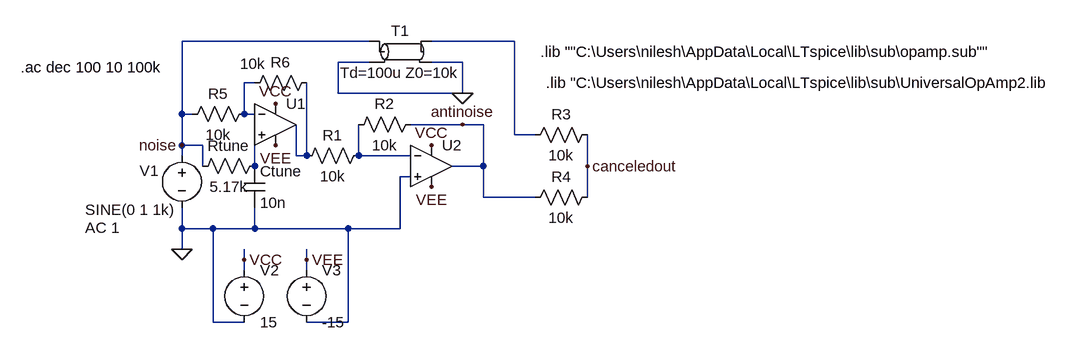
[diagram p0: schematic NC_schematic_real_world_model.asc]
NC_schematic_real_world_model.asc, the LTspice schematic file:
Version 4.1
SHEET 1 1500 680
WIRE 336 -48 48 -48
WIRE 560 -48 432 -48
WIRE 336 -16 288 -16
WIRE 480 -16 432 -16
WIRE 160 16 144 16
WIRE 288 32 288 -16
WIRE 480 32 480 -16
WIRE 480 32 288 32
WIRE 48 64 48 -48
WIRE 64 64 48 64
WIRE 144 64 144 16
WIRE 160 64 144 64
WIRE 480 80 400 80
WIRE 512 80 480 80
WIRE 560 96 560 -48
WIRE 592 96 560 96
WIRE 48 112 48 64
WIRE 80 112 48 112
WIRE 48 128 48 112
WIRE 224 128 224 80
WIRE 240 128 240 16
WIRE 240 128 224 128
WIRE 320 128 320 80
WIRE 400 128 320 128
WIRE 80 144 80 112
WIRE 160 144 160 96
WIRE 512 144 512 80
WIRE 512 144 464 144
WIRE 672 144 672 96
WIRE 400 160 384 160
WIRE 512 192 512 144
WIRE 592 192 512 192
WIRE 672 192 672 144
WIRE 48 240 48 208
WIRE 96 240 48 240
WIRE 160 240 160 208
WIRE 160 240 96 240
WIRE 304 240 160 240
WIRE 384 240 384 160
WIRE 384 240 304 240
WIRE 48 272 48 240
WIRE 144 288 144 272
WIRE 240 288 240 272
WIRE 144 304 144 288
WIRE 240 304 240 288
WIRE 96 384 96 240
WIRE 144 384 96 384
WIRE 304 384 304 240
WIRE 304 384 240 384
FLAG 48 272 0
FLAG 480 80 antinoise
FLAG 672 144 canceledout
FLAG 480 32 0
FLAG 48 112 noise
FLAG 144 288 VCC
FLAG 240 288 VEE
FLAG 192 48 VCC
FLAG 432 112 VCC
FLAG 432 176 VEE
FLAG 192 112 VEE
SYMBOL voltage 48 112 R0
WINDOW 123 -149 127 Left 2
WINDOW 39 0 0 Left 0
WINDOW 0 -65 39 Left 2
WINDOW 3 -149 99 Left 2
SYMATTR Value2 AC 1
SYMATTR InstName V1
SYMATTR Value SINE(0 1 1k)
SYMBOL res 336 112 R90
WINDOW 0 0 56 VBottom 2
WINDOW 3 32 56 VTop 2
SYMATTR InstName R1
SYMATTR Value 10k
SYMBOL res 416 64 R90
WINDOW 0 0 56 VBottom 2
WINDOW 3 32 56 VTop 2
SYMATTR InstName R2
SYMATTR Value 10k
SYMBOL res 688 80 R90
WINDOW 0 0 56 VBottom 2
WINDOW 3 32 56 VTop 2
SYMATTR InstName R3
SYMATTR Value 10k
SYMBOL res 688 176 R90
WINDOW 0 0 56 VBottom 2
WINDOW 3 32 56 VTop 2
SYMATTR InstName R4
SYMATTR Value 10k
SYMBOL tline 384 -32 R0
SYMATTR InstName T1
SYMATTR Value Td=100u Z0=10k
SYMBOL res 160 48 R90
WINDOW 0 0 56 VBottom 2
WINDOW 3 32 56 VTop 2
SYMATTR InstName R5
SYMATTR Value 10k
SYMBOL cap 144 144 R0
SYMATTR InstName Ctune
SYMATTR Value 10n
SYMBOL res 176 128 R90
WINDOW 0 0 56 VBottom 2
WINDOW 3 32 56 VTop 2
SYMATTR InstName Rtune
SYMATTR Value 5.17k
SYMBOL OpAmps\\UniversalOpAmp2 432 144 R0
SYMATTR InstName U2
SYMBOL res 256 0 R90
WINDOW 0 0 56 VBottom 2
WINDOW 3 -29 99 VTop 2
SYMATTR InstName R6
SYMATTR Value 10k
SYMBOL OpAmps\\UniversalOpAmp2 192 80 R0
SYMATTR InstName U1
SYMBOL voltage 144 288 R0
SYMATTR InstName V2
SYMATTR Value 15
SYMBOL voltage 240 288 R0
SYMATTR InstName V3
SYMATTR Value -15
TEXT 600 -32 Left 2 !.lib ""C:\\Users\\nilesh\\AppData\\Local\\LTspice\\lib\\sub\\opamp.sub""
TEXT -200 -8 Left 2 !.ac dec 100 10 100k
TEXT 608 16 Left 2 !.lib "C:\\Users\\nilesh\\AppData\\Local\\LTspice\\lib\\sub\\UniversalOpAmp2.lib

The netlist it stands for:
* NC_schematic_real_world_model.asc
V1 noise 0 SINE(0 1 1k) AC 1
R1 N004 N003 10k
R2 antinoise N004 10k
R3 canceledout N001 10k
R4 canceledout antinoise 10k
T1 noise 0 N001 0 Td=100u Z0=10k
R5 N002 noise 10k
Ctune N005 0 10n
Rtune N005 noise 5.17k
X§U2 0 N004 VCC VEE antinoise level2 Avol=1Meg GBW=10Meg Slew=10Meg Ilimit=25m Rail=0 Vos=0 En=0 Enk=0 In=0 Ink=0 Rin=500Meg  ; pins In+ In- V+ V- OUT
R6 N003 N002 10k
X§U1 N005 N002 VCC VEE N003 level2 Avol=1Meg GBW=10Meg Slew=10Meg Ilimit=25m Rail=0 Vos=0 En=0 Enk=0 In=0 Ink=0 Rin=500Meg  ; pins In+ In- V+ V- OUT
V2 VCC 0 15
V3 VEE 0 -15
.lib ""C:\Users\nilesh\AppData\Local\LTspice\lib\sub\opamp.sub""
.ac dec 100 10 100k
.lib "C:\Users\nilesh\AppData\Local\LTspice\lib\sub\UniversalOpAmp2.lib
.lib UniversalOpAmp2.lib
.backanno
.end